# EAGLE design MkI (EAGLE 9.5.2)
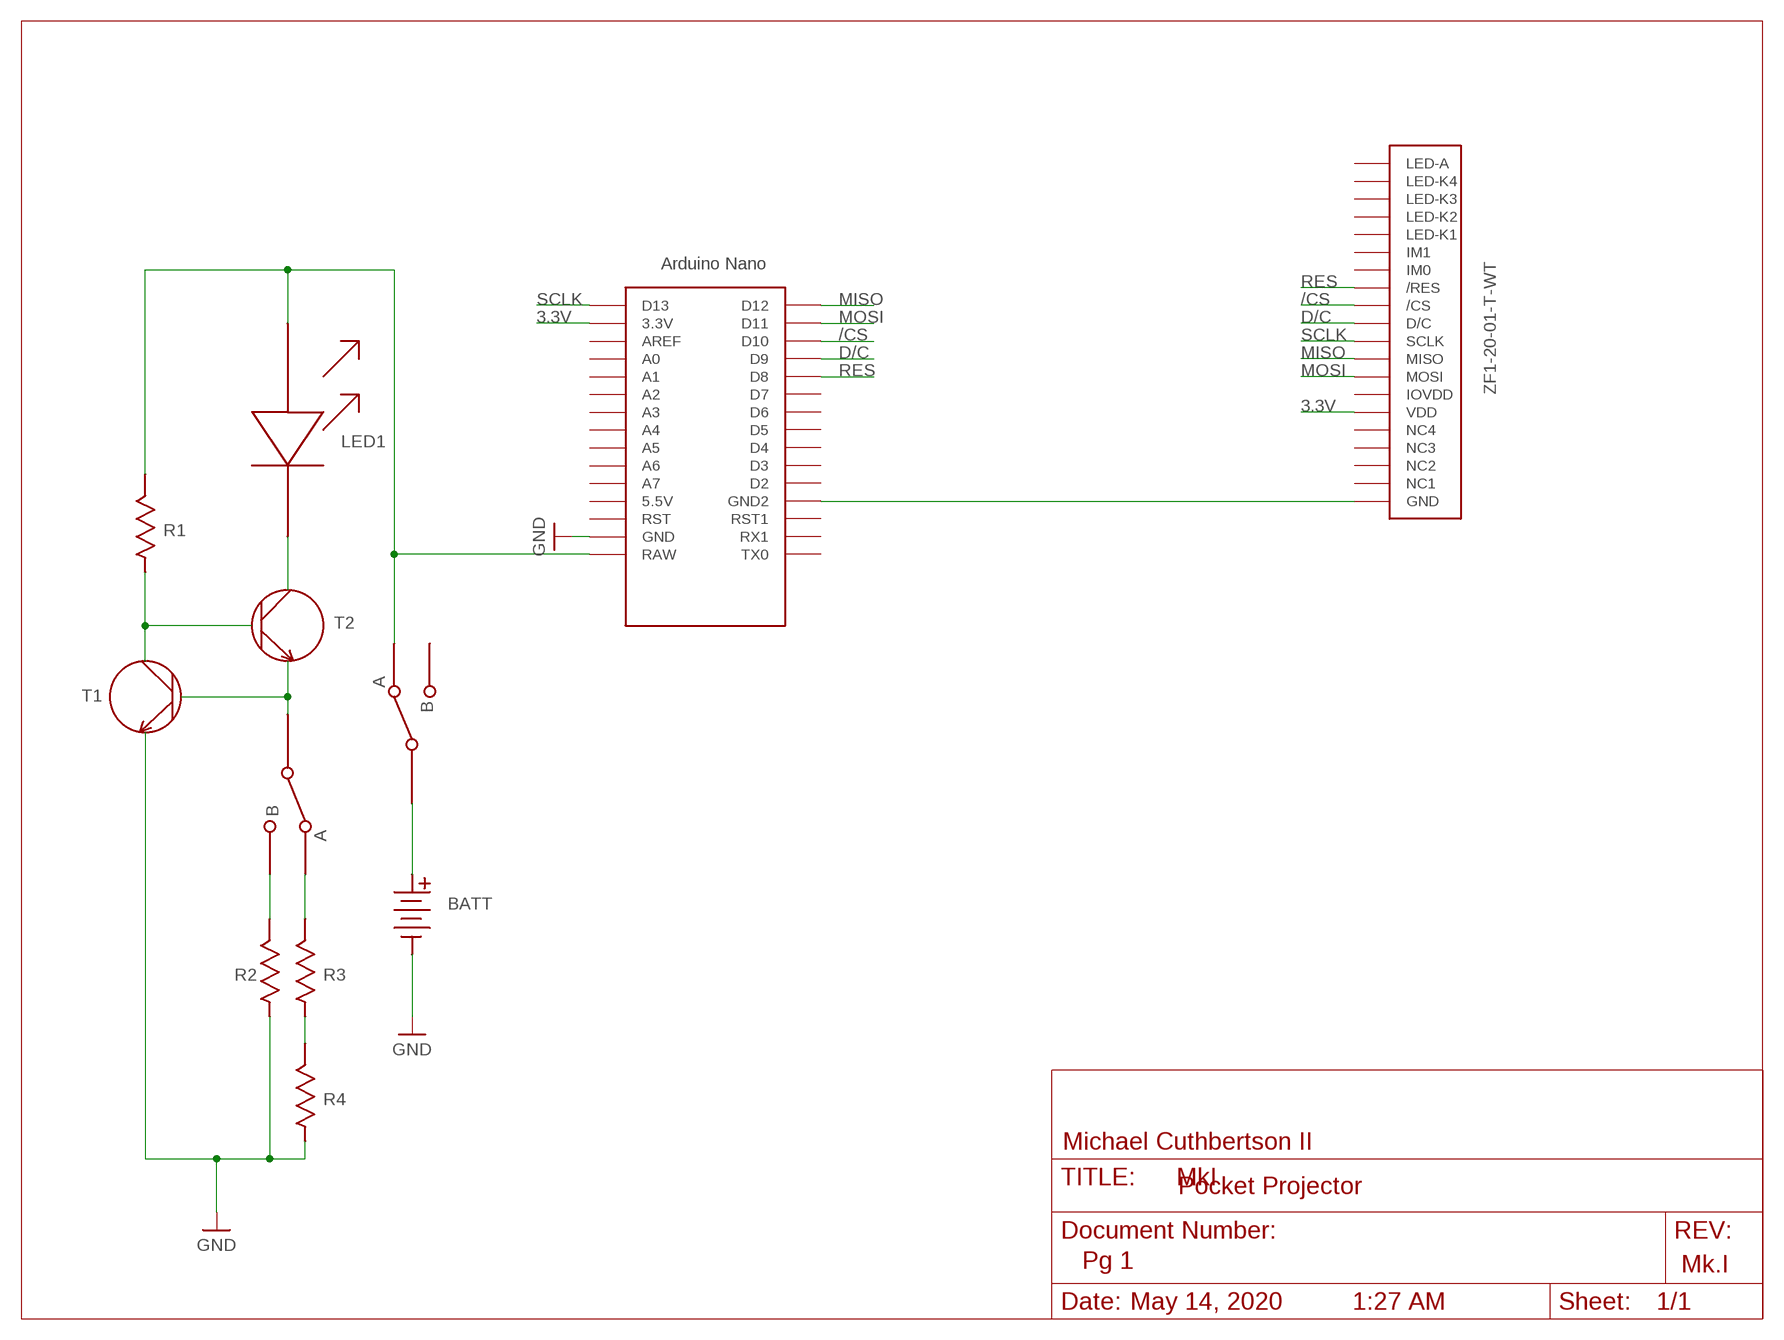
[diagram p0: schematic, sheet 1]

## Parts
R1  2.2k  ERJ1T  [ERJ1T]
R2  130  CRCW2512  [CRCW2512]
R3  200  CRCW2512  [CRCW2512]
R4  200  CRCW2512  [CRCW2512]
S1  A107673-ND  [A107673-ND]
S2  A107673-ND  [A107673-ND]
T1  BC547  [BC547]
T2  BD139  [BD139]
U$1  NANO  [NANO]
U$3  XHGAWT-00-0000-00000HXE1  [XHGAWT-00-0000-00000HXE1]
U$5  9v  BATT  [BATT]
U$6  ZF1-20-01-T-WT  [ZF1-20-01-T-WT]

## Nets
3.3V: U$1.3.3V U$6.VDD
/CS: U$1.D10 U$6./CS
D/C: U$1.D9 U$6.D/C
GND: R2.P$1 R4.P$1 T1.P$3 U$1.GND U$5.GND
MISO: U$1.D12 U$6.MISO
MOSI: U$1.D11 U$6.MOSI
N$1: T2.P$2 U$3.P$1
N$2: S2.P$1 T1.P$1 T2.P$3
N$3: R1.P$1 T1.P$2 T2.P$1
N$4: R3.P$1 R4.P$2
N$5: R1.P$2 S1.P$2 U$1.RAW U$3.P$2
N$6: R2.P$2 S2.P$3
N$7: R3.P$2 S2.P$2
N$8: S1.P$1 U$5.VCC
N$9: U$1.GND1(GND2) U$6.GND
RES: U$1.D8 U$6./RES
SCLK: U$1.D13 U$6.SCLK
Unconnected: S1.P$3 U$1.5V(5.5V) U$1.A0 U$1.A1 U$1.A2 U$1.A3 U$1.A4 U$1.A5 U$1.A6 U$1.A7 U$1.AREF U$1.D2 U$1.D3 U$1.D4 U$1.D5 U$1.D6 U$1.D7 U$1.ICSP1 U$1.ICSP2 U$1.ICSP3 U$1.ICSP4 U$1.ICSP5 U$1.ICSP6 U$1.RST U$1.RST1 U$1.RX1 U$1.TX0 U$6.IM0 U$6.IM1 U$6.IOVDD U$6.LED-A U$6.LED-K1 U$6.LED-K2 U$6.LED-K3 U$6.LED-K4 U$6.NC1 U$6.NC2 U$6.NC3 U$6.NC4

## Notes on the sheet
- LED1
- R1
- T2
- T1
- BATT
- R2 | R3
- R4
- Michael Cuthbertson II
- Pocket Projector
- Pg 1 | Mk.I
- May 14, 2020 | 1:27 AM

## Library data of the parts
R1 = Thick Film Chip Resistors:ERJ1T
R2-R4 = Thick Film Chip Resistors:CRCW2512
S1 S2 = A107673-ND Switch:A107673-ND
T1 = FPE Transistors:BC547
T2 = FPE Transistors:BD139
U$1 = Arduino-clone corrected:NANO: Arduino Nano
U$3 = Cree LED:XHGAWT-00-0000-00000HXE1
U$5 = FPE:BATT
U$6 = LCD Connectors:ZF1-20-01-T-WT

## Board
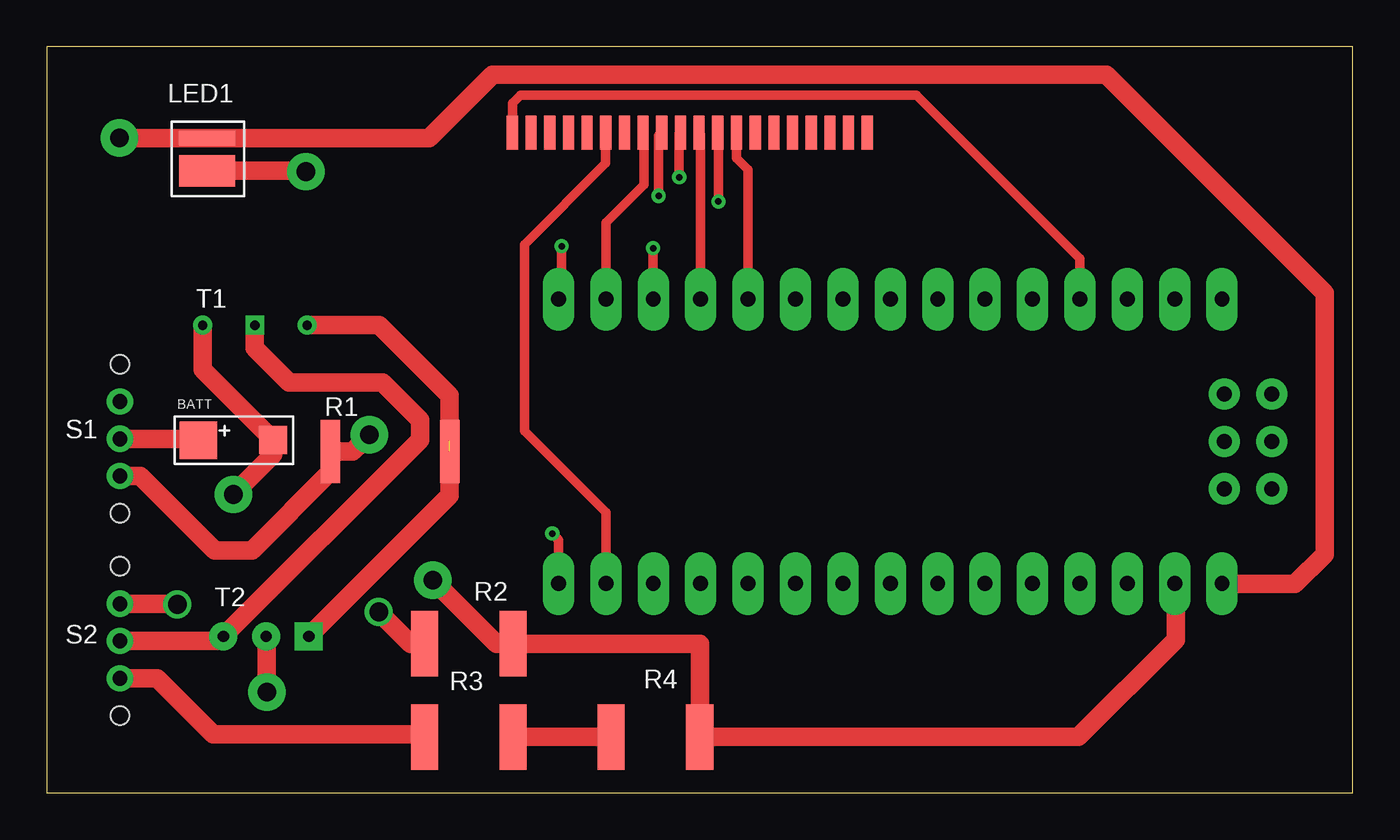
[diagram p1: board, top side]
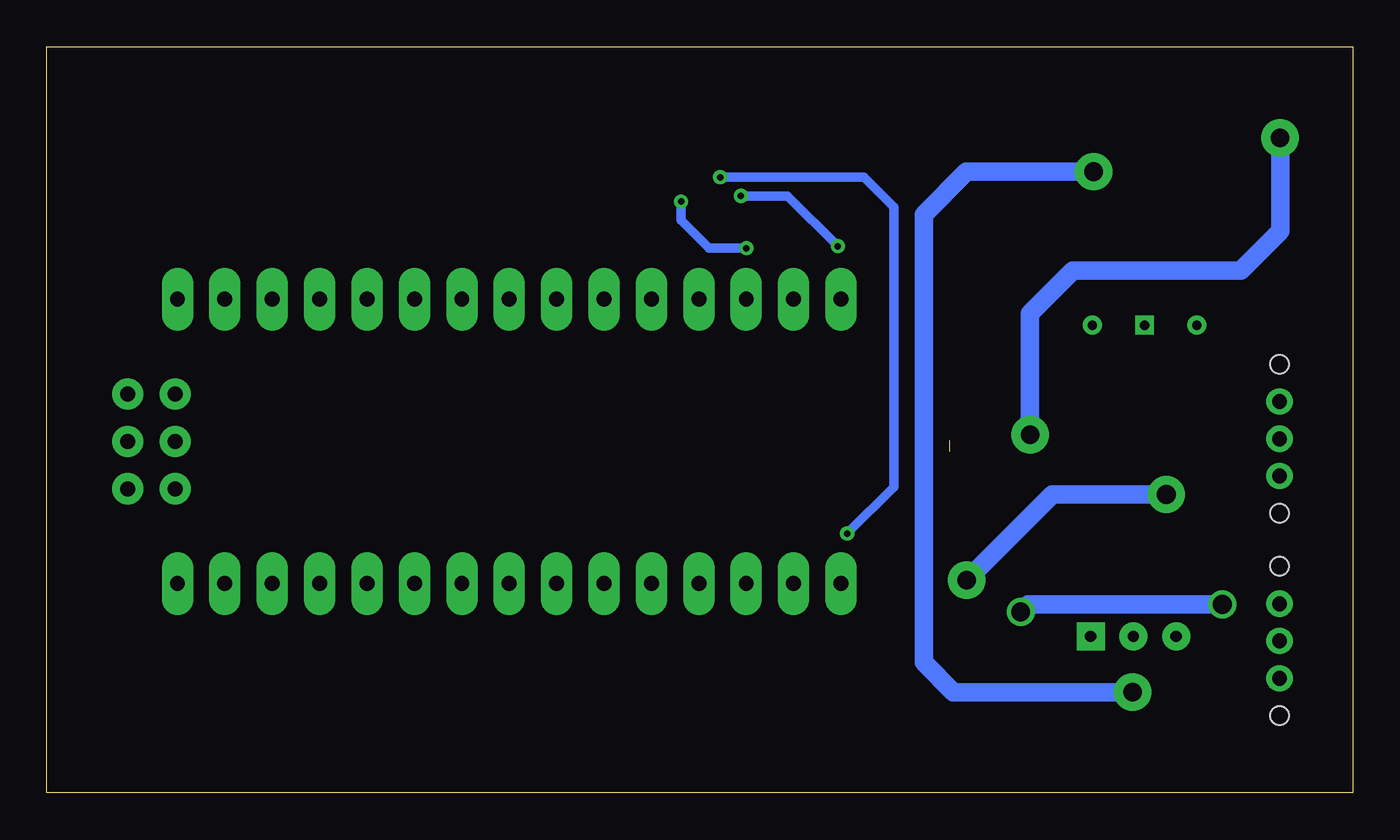
[diagram p2: board, bottom side, seen from below]

Size 70 x 40 mm. Coordinates in mm from the lower left corner, seen from the top.
Outline: 0,0 70,0 70,40 0,40 0,0
Copper layers (1*16): Top 0.035mm / dielectric 1.5mm / Bottom 0.035mm
Design rules "default": minimum track width 6mil, minimum drill 0.35mm, track to track 6mil, track to pad 6mil, pad to pad 6mil, via to via 6mil, smd to smd 6mil, copper to edge 40mil, drill to drill 6mil, minimum pad ring 10mil, minimum via ring 8mil, stop-mask expansion 4mil, vias tented up to drill 0mil, thermal gap 10mil

### Footprints (pad centres in the part's own frame; a part is rotated, then mirrored left to right if it is on the bottom)
ERJ1T = smd 1.05 x 3.4: P$1 0.4,1.7; P$2 6.8,1.7
CRCW2512 = smd 1.45 x 3.5: P$1 0,0; P$2 4.75,0
A107673-ND = drill 0.8 pad 1.4: P$1 4,0; P$2 2,0; P$3 6,0 | hole 1: 0,0; 8,0
BC547 = drill 0.5 square: P$1 2.8,0 | drill 0.5: P$2 5.6,0; P$3 0,0
BD139 = drill 0.6 pad 1.5 square: P$1 0,0 | drill 0.6 pad 1.5: P$2 2.29,0; P$3 4.58,0
NANO = drill 0.8 pad 1.676 long: 3.3V -10.16,24.13; 5V -10.16,-1.27; A0 -10.16,19.05; A1 -10.16,16.51; A2 -10.16,13.97; A3 -10.16,11.43; A4 -10.16,8.89; A5 -10.16,6.35; A6 -10.16,3.81; A7 -10.16,1.27; AREF -10.16,21.59; D2 5.08,1.27; D3 5.08,3.81; D4 5.08,6.35; D5 5.08,8.89; D6 5.08,11.43; D7 5.08,13.97; D8 5.08,16.51; D9 5.08,19.05; D10 5.08,21.59; D11 5.08,24.13; D12 5.08,26.67; D13 -10.16,26.67; GND -10.16,-6.35; GND1 5.08,-1.27; RAW -10.16,-8.89; RST -10.16,-3.81; RST1 5.08,-3.81; RX1 5.08,-6.35; TX0 5.08,-8.89 | drill 0.8 pad 1.676: ICSP1 -5.08,-11.557; ICSP2 -5.08,-9.017; ICSP3 -2.54,-11.557; ICSP4 -2.54,-9.017; ICSP5 0,-11.557; ICSP6 0,-9.017
XHGAWT-00-0000-00000HXE1 = smd 1.7 x 3: P$1 0.85,1.5 | smd 0.8 x 3: P$2 2.6,1.5
BATT = smd 1.5 x 1.5: GND 4,0 | smd 2 x 2: VCC 0,0
ZF1-20-01-T-WT = smd 0.599 x 1.803: /CS 11.008,1.001; /RES 12.009,1.001; D/C 10.008,1.001; GND 0,1.001; IM0 13.01,1.001; IM1 14.011,1.001; IOVDD 6.005,1.001; LED-A 19.014,1.001; LED-K1 15.011,1.001; LED-K2 16.012,1.001; LED-K3 17.013,1.001; LED-K4 18.014,1.001; MISO 8.006,1.001; MOSI 7.005,1.001; NC1 1.001,1.001; NC2 2.002,1.001; NC3 3.002,1.001; NC4 4.003,1.001; SCLK 9.007,1.001; VDD 5.004,1.001

### Placement (x,y rotation side)
R1  22,20 180 top
R2  25,8 180 top
R3  25,3 180 top
R4  35,3 180 top
S1  3.93,14.98 90 top
S2  3.93,4.14 90 top
T1  8.36,25.07 0 top
T2  14.05,8.39 180 top
U$1  54.1,21.38 90 top
U$3  10.09,32.49 90 top
U$5  8.14,18.91 0 top
U$6  24.96,34.39 0 top

### Tracks (layer width: path | path; a pad name or v marks a point on that pad's centre or on a via)
3.3V
  Top 0.5: U$1.3.3V 29.97,15.03 25.6,19.4 25.6,29.4 29.96,33.76 U$6.VDD
/CS  (via drill 0.35 pad 0.5)
  Top 0.5: U$1.D10 v32.5,29.2 | v36,31.7 36,35.36 U$6./CS
  Bottom 0.5: v32.5,29.2 34.5,29.2 36,30.7 v36,31.7
D/C
  Top 0.5: U$6.D/C 35.05,35.31 U$1.D9
GND  (via drill 1 pad 2)
  Top 1: T1.P$3 8.36,22.69 U$5.GND 12.14,18.14 v10,16 | U$1.GND 60.5,11.17 60.5,8.2 55.3,3 R4.P$1 35,8 R2.P$1 24.1,8 v20.7,11.4
  Bottom 1: v10,16 16.1,16 v20.7,11.4
MISO  (via drill 0.35 pad 0.5)
  Top 0.5: U$1.D12 27.6,26.63 v27.6,29.3 | v32.8,32 32.8,35.23 U$6.MISO
  Bottom 0.5: v27.6,29.3 30.3,32 v32.8,32
MOSI
  Top 0.5: U$1.D11 29.97,30.57 32,32.6 32,35.36 U$6.MOSI
N$1  (via drill 1 pad 2)
  Top 1: T2.P$2 11.8,8.35 v11.8,5.4 | v13.9,33.3 13.86,33.34 U$3.P$1
  Bottom 1: v11.8,5.4 21.4,5.4 23,7 23,31 20.7,33.3 v13.9,33.3
N$2
  Top 1: S2.P$1 9.22,8.14 T2.P$3 20,18.92 20,20 18,22 13,22 11.16,23.84 T1.P$1
N$3  (1 unrouted)
  Top 1: T2.P$1 21.6,15.94 R1.P$1 | T1.P$2 17.83,25.07 21.6,21.3 21.6,18.9
N$4
  Top 1: R4.P$2 R3.P$1
N$5  (via drill 1 pad 2)
  Top 1: S1.P$2 5.02,16.98 9,13 11,13 15.2,17.2 R1.P$2 16.4,18.3 v17.3,19.2 | U$1.RAW 63.01,11.2 66.9,11.2 68.48,12.78 68.48,26.8 56.8,38.48 23.88,38.48 20.49,35.09 U$3.P$2 v3.91,35.09 v3.9,35.1
  Bottom 1: v17.3,19.2 17.3,25.7 15,28 6,28 3.9,30.1 v3.9,35.1
N$6  (via drill 1 pad 1)
  Top 1: S2.P$3 6.96,10.14 v7,10.1 | v17.8,9.7 19.5,8 R2.P$2
  Bottom 1: v7,10.1 17.4,10.1 v17.8,9.7
N$7
  Top 1: S2.P$2 5.93,6.14 8.93,3.14 20.11,3.14 R3.P$2
N$8
  Top 1: S1.P$1 8.07,18.98 U$5.VCC
N$9
  Top 0.5: U$6.GND 24.96,36.96 25.4,37.4 46.6,37.4 55.37,28.63 U$1.GND1
RES
  Top 0.5: U$1.D8 37.59,33.41 36.97,34.03 U$6./RES
SCLK  (via drill 0.35 pad 0.5)
  Top 0.5: v33.9,33 33.9,35.32 U$6.SCLK | U$1.D13 27.43,13.57 v27.1,13.9
  Bottom 0.5: v27.1,13.9 24.6,16.4 24.6,31.4 26.2,33 v33.9,33

### Text on the board
tPlace: LED1 | T1 | R1 | S1 | T2 | R2 | S2 | R4 | R3